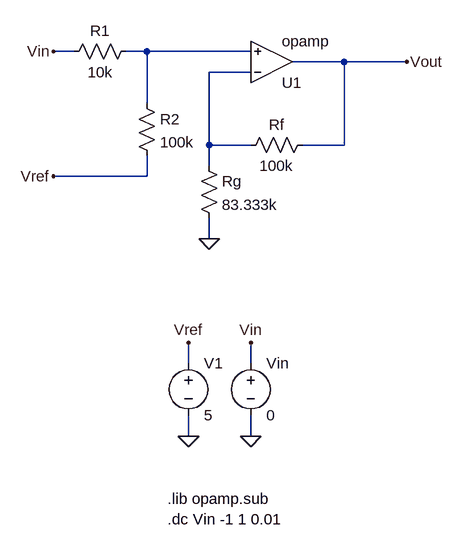
[diagram p0: schematic mpbp.asc]
mpbp.asc, the LTspice schematic file:
Version 4
SHEET 1 880 800
WIRE -112 64 -144 64
WIRE 0 64 -32 64
WIRE 160 64 0 64
WIRE 304 80 224 80
WIRE 400 80 304 80
WIRE 160 96 96 96
WIRE 0 144 0 64
WIRE 96 208 96 96
WIRE 160 208 96 208
WIRE 304 208 304 80
WIRE 304 208 240 208
WIRE 96 240 96 208
WIRE 0 256 0 224
WIRE 0 256 -144 256
WIRE 96 352 96 320
WIRE 64 544 64 512
WIRE 160 544 160 512
WIRE 64 656 64 624
WIRE 160 656 160 624
FLAG 64 512 Vref
FLAG 64 656 0
FLAG 160 656 0
FLAG 400 80 Vout
FLAG -144 64 Vin
FLAG 160 512 Vin
FLAG 96 352 0
FLAG -144 256 Vref
SYMBOL voltage 160 528 R0
SYMATTR InstName Vin
SYMATTR Value 0
SYMBOL res 256 192 R90
WINDOW 0 0 56 VBottom 2
WINDOW 3 32 56 VTop 2
SYMATTR InstName Rf
SYMATTR Value 100k
SYMBOL voltage 64 528 R0
SYMATTR InstName V1
SYMATTR Value 5
SYMBOL Opamps\\opamp 192 144 M180
SYMATTR InstName U1
SYMBOL res 80 224 R0
SYMATTR InstName Rg
SYMATTR Value 83.333k
SYMBOL res -16 48 R90
WINDOW 0 0 56 VBottom 2
WINDOW 3 32 56 VTop 2
SYMATTR InstName R1
SYMATTR Value 10k
SYMBOL res -16 128 R0
SYMATTR InstName R2
SYMATTR Value 100k
TEXT 32 784 Left 2 !.dc Vin -1 1 0.01
TEXT 32 752 Left 2 !.lib opamp.sub

The netlist it stands for:
* mpbp.asc
Vin Vin 0 0
Rf Vout N002 100k
V1 Vref 0 5
XU1 N002 N001 Vout opamp Aol=100K GBW=10Meg  ; pins invin noninvin out
Rg N002 0 83.333k
R1 N001 Vin 10k
R2 N001 Vref 100k
.dc Vin -1 1 0.01
.lib opamp.sub
.backanno
.end